# EAGLE design attiny (EAGLE 5.06)
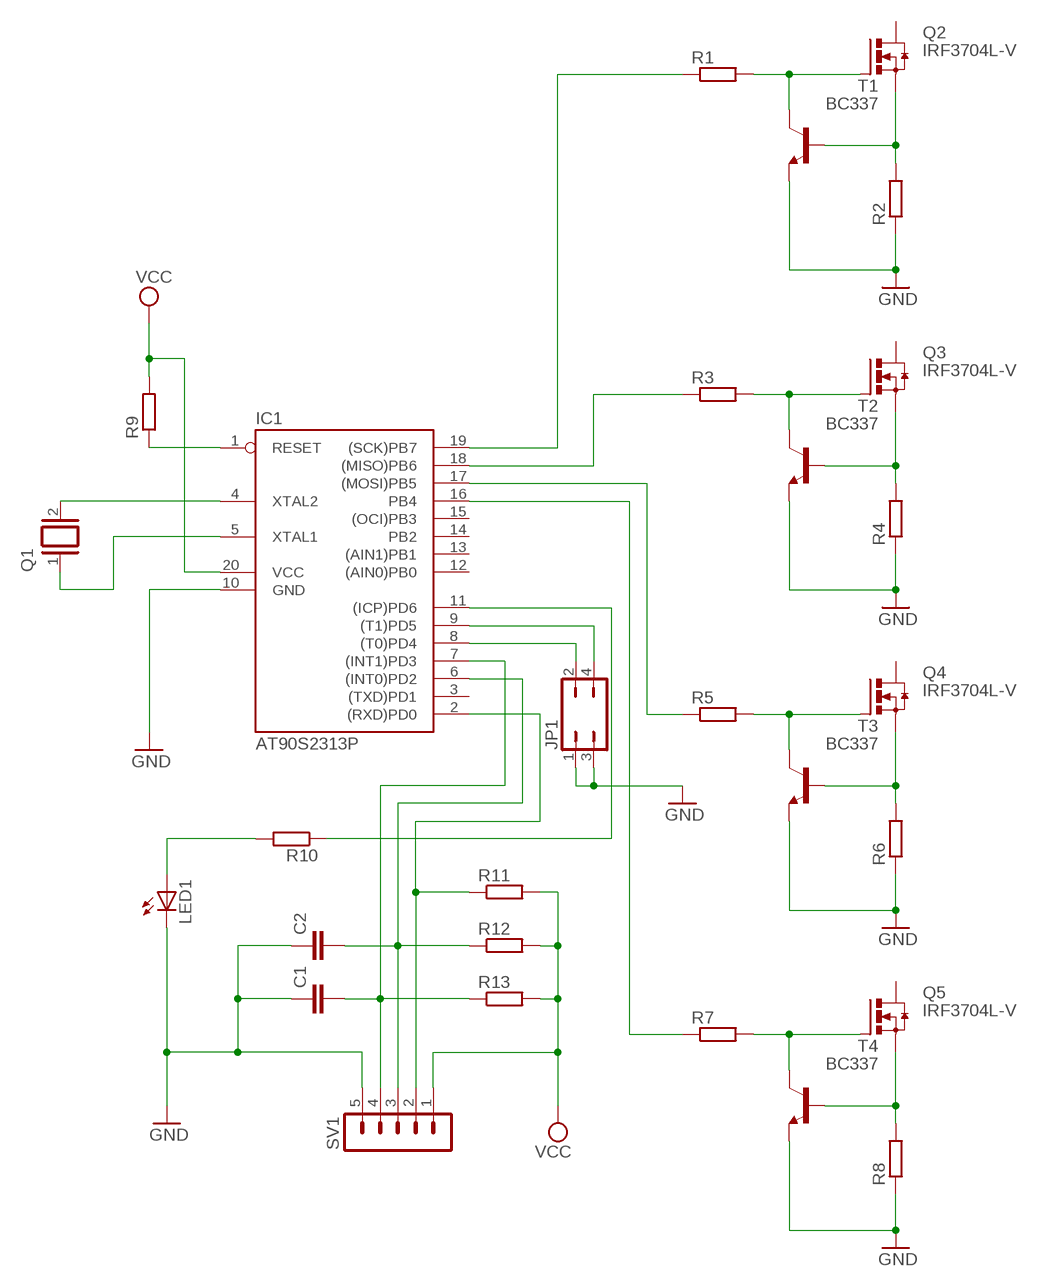
[diagram p0: schematic, sheet 1]

## Parts
C1  C-EU050-025X075  [C050-025X075]
C2  C-EU050-025X075  [C050-025X075]
IC1  AT90S2313P  [DIL20]
JP1  JP2Q  [JP2Q]
LED1  LED3MM  [LED3MM]
Q1  XTAL/S  [QS]
Q2  IRF3704L-V  [TO262-V]
Q3  IRF3704L-V  [TO262-V]
Q4  IRF3704L-V  [TO262-V]
Q5  IRF3704L-V  [TO262-V]
R1  R-EU_0207/15  [0207/15]
R2  R-EU_0922V  [0922V]
R3  R-EU_0207/15  [0207/15]
R4  R-EU_0922V  [0922V]
R5  R-EU_0207/15  [0207/15]
R6  R-EU_0922V  [0922V]
R7  R-EU_0207/15  [0207/15]
R8  R-EU_0922V  [0922V]
R9  R-EU_0207/10  [0207/10]
R10  R-EU_0207/10  [0207/10]
R11  R-EU_0207/10  [0207/10]
R12  R-EU_0207/10  [0207/10]
R13  R-EU_0207/15  [0207/15]
SV1  MA05-1  [MA05-1]
T1  BC337  [TO92]
T2  BC337  [TO92]
T3  BC337  [TO92]
T4  BC337  [TO92]

## Nets
GND: C1.1 C2.1 IC1.10(GND) JP1.1 JP1.3 LED1.K(C) R2.1 R4.1 R6.1 R8.1 SV1.5 T1.1(E) T2.1(E) T3.1(E) T4.1(E)
N$1: Q2.3(S) R2.2 T1.2(B)
N$2: Q2.1(G) R1.2 T1.3(C)
N$3: IC1.9((T1)PD5) JP1.4
N$4: Q3.3(S) R4.2 T2.2(B)
N$6: Q4.3(S) R6.2 T3.2(B)
N$7: Q4.1(G) R5.2 T3.3(C)
N$8: Q5.3(S) R8.2 T4.2(B)
N$9: Q5.1(G) R7.2 T4.3(C)
N$10: IC1.19((SCK)PB7) R1.1
N$11: IC1.18((MISO)PB6) R3.1
N$12: IC1.17((MOSI)PB5) R5.1
N$13: IC1.16(PB4) R7.1
N$14: IC1.4(XTAL2) Q1.2
N$15: IC1.5(XTAL1) Q1.1
N$16: IC1.8((T0)PD4) JP1.2
N$17: Q3.1(G) R3.2 T2.3(C)
N$19: C1.2 IC1.7((INT1)PD3) R13.1 SV1.4
N$20: C2.2 IC1.6((INT0)PD2) R12.1 SV1.3
N$21: IC1.2((RXD)PD0) R11.1 SV1.2
N$22: IC1.11((ICP)PD6) R10.1
N$23: LED1.A R10.2
N$25: IC1.1(RESET) R9.1
VCC: IC1.20(VCC) R9.2 R11.2 R12.2 R13.2 SV1.1
Unconnected: IC1.3((TXD)PD1) IC1.12((AIN0)PB0) IC1.13((AIN1)PB1) IC1.14(PB2) IC1.15((OCI)PB3) Q2.2(D) Q3.2(D) Q4.2(D) Q5.2(D)

## Library data of the parts
C1 C2 = rcl:C-EU: CAPACITOR, European symbol
IC1 = atmel:AT90S2313: MICROCONTROLLER 2 Kbytes FLASH 128 bytes SRAM 128 bytes EEPROM UART
JP1 = jumper:JP2Q: JUMPER
LED1 = led:LED: LED OSRAM: - CHIPLED LG R971, LG N971, LY N971, LG Q971, LY Q971, LO R971, LY R971 LH N974, LH R974 LS Q976, LO Q976, LY Q976 LO Q996 - Hyper CHIPLED LW Q18S LB Q993, LB Q99A, LB R99A - SideLED LS A670, LO A670, LY A670, LG A670, LP A670 LB A673, LV A673, LT A673, LW A673 LH A674 LY A675 LS A676, LA A676, LO A676, LY A676, LW A676 LS A679, LY A679, LG A679 - Hyper Micro SIDELED® LS Y876, LA Y876, LO Y876, LY Y876 LT Y87S - SmartLED LW L88C, LW L88S LB L89C, LB L89S, LG L890 LS L89K, LO L89K, LY L89K LS L896, LA L896, LO L896, LY L896 - TOPLED LS T670, LO T670, LY T670, LG T670, LP T670 LSG T670, LSP T670, LSY T670, LOP T670, LYG T670 LG T671, LOG T671, LSG T671 LB T673, LV T673, LT T673, LW T673 LH T674 LS T676, LA T676, LO T676, LY T676, LB T676, LH T676, LSB T676, LW T676 LB T67C, LV T67C, LT T67C, LS T67K, LO T67K, LY T67K, LW E67C LS E67B, LA E67B, LO E67B, LY E67B, LB E67C, LV E67C, LT E67C LW T67C LS T679, LY T679, LG T679 LS T770, LO T770, LY T770, LG T770, LP T770 LB T773, LV T773, LT T773, LW T773 LH T774 LS E675, LA E675, LY E675, LS T675 LS T776, LA T776, LO T776, LY T776, LB T776 LHGB T686 LT T68C, LB T68C - Hyper Mini TOPLED® LB M676 - Mini TOPLED Santana® LG M470 LS M47K, LO M47K, LY M47K Source: http://www.osram.convergy.de LUXEON: - LUMILED® LXK2-PW12-R00, LXK2-PW12-S00, LXK2-PW14-U00, LXK2-PW14-V00 LXK2-PM12-R00, LXK2-PM12-S00, LXK2-PM14-U00 LXK2-PE12-Q00, LXK2-PE12-R00, LXK2-PE12-S00, LXK2-PE14-T00, LXK2-PE14-U00 LXK2-PB12-K00, LXK2-PB12-L00, LXK2-PB12-M00, LXK2-PB14-N00, LXK2-PB14-P00, LXK2-PB14-Q00 LXK2-PR12-L00, LXK2-PR12-M00, LXK2-PR14-Q00, LXK2-PR14-R00 LXK2-PD12-Q00, LXK2-PD12-R00, LXK2-PD12-S00 LXK2-PH12-R00, LXK2-PH12-S00 LXK2-PL12-P00, LXK2-PL12-Q00, LXK2-PL12-R00 Source: www.luxeon.com KINGBRIGHT: KA-3528ASYC Source: www.kingbright.com
Q1 = special:XTAL/S: CRYSTAL
Q2-Q5 = transistor-power:IRF3704: SMPS MOSFET HEXFET® Power MOSFET Source: http://www.irf.com/product-info/datasheets/data/irf3704.pdf
R1-R13 = rcl:R-EU_: RESISTOR, European symbol
SV1 = con-lstb:MA05-1: PIN HEADER
T1-T4 = transistor:BC337: NPN TRANSISTOR

## Board
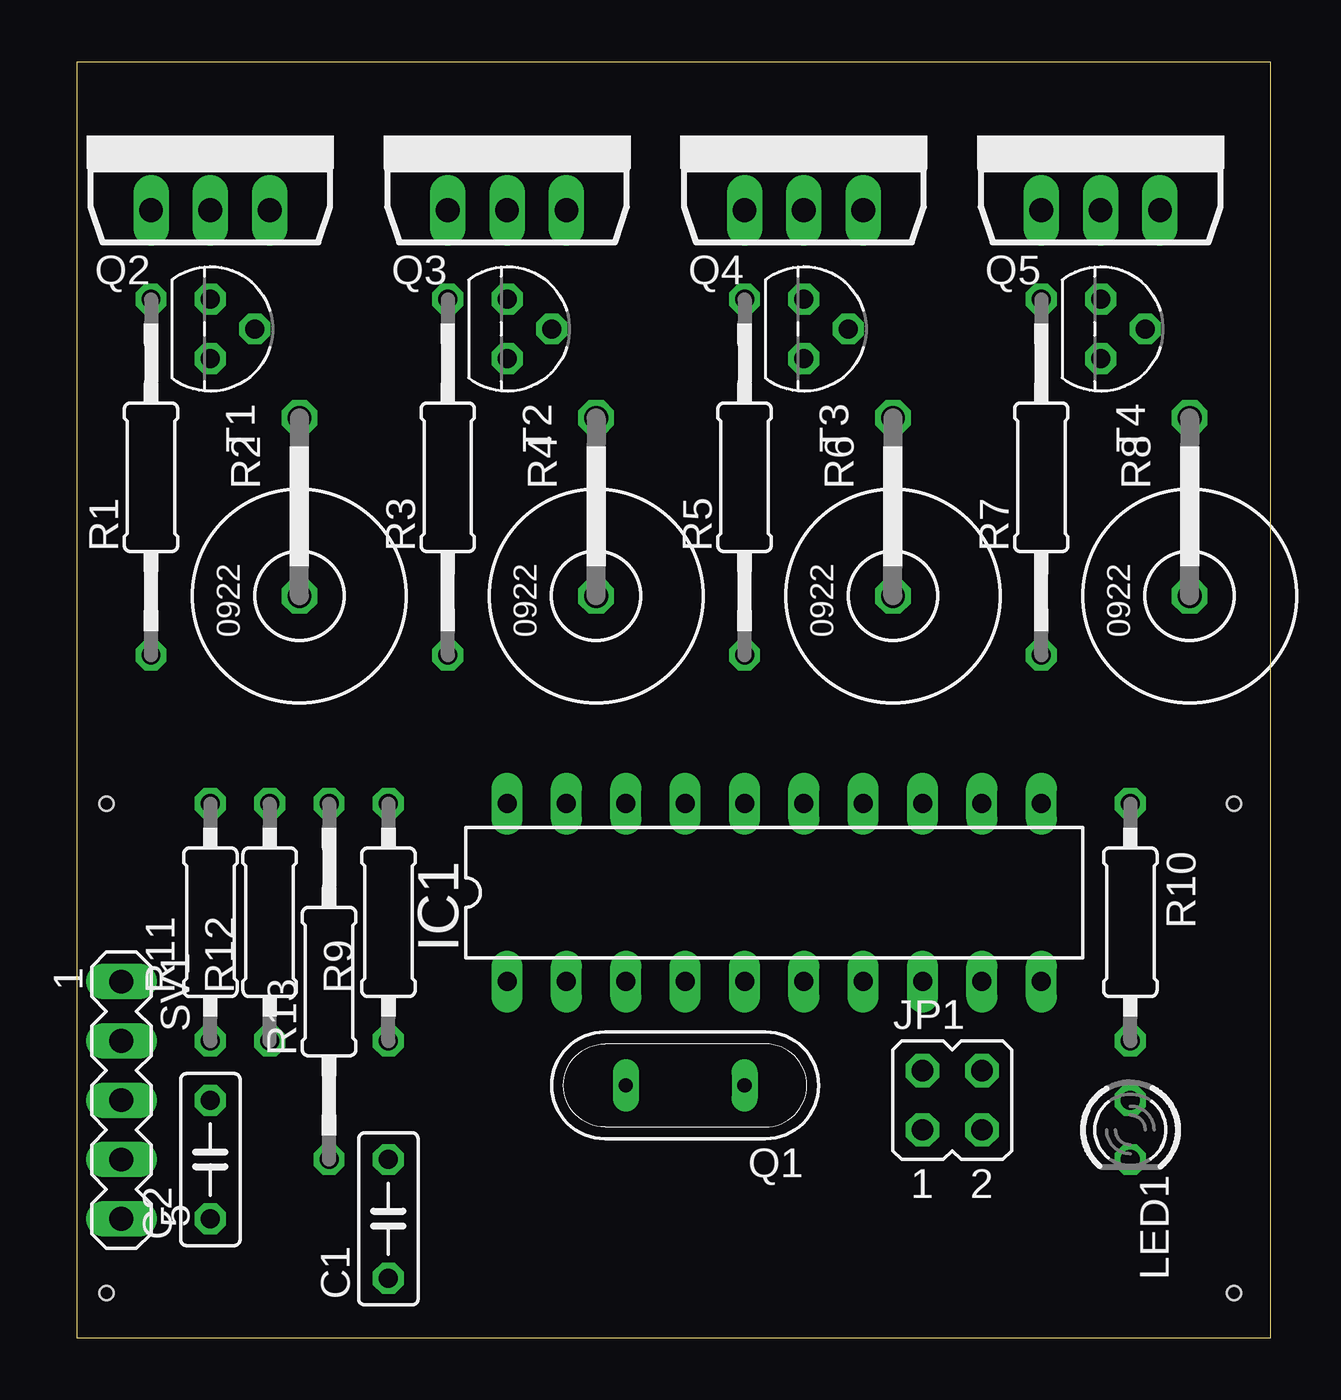
[diagram p1: board, top side]
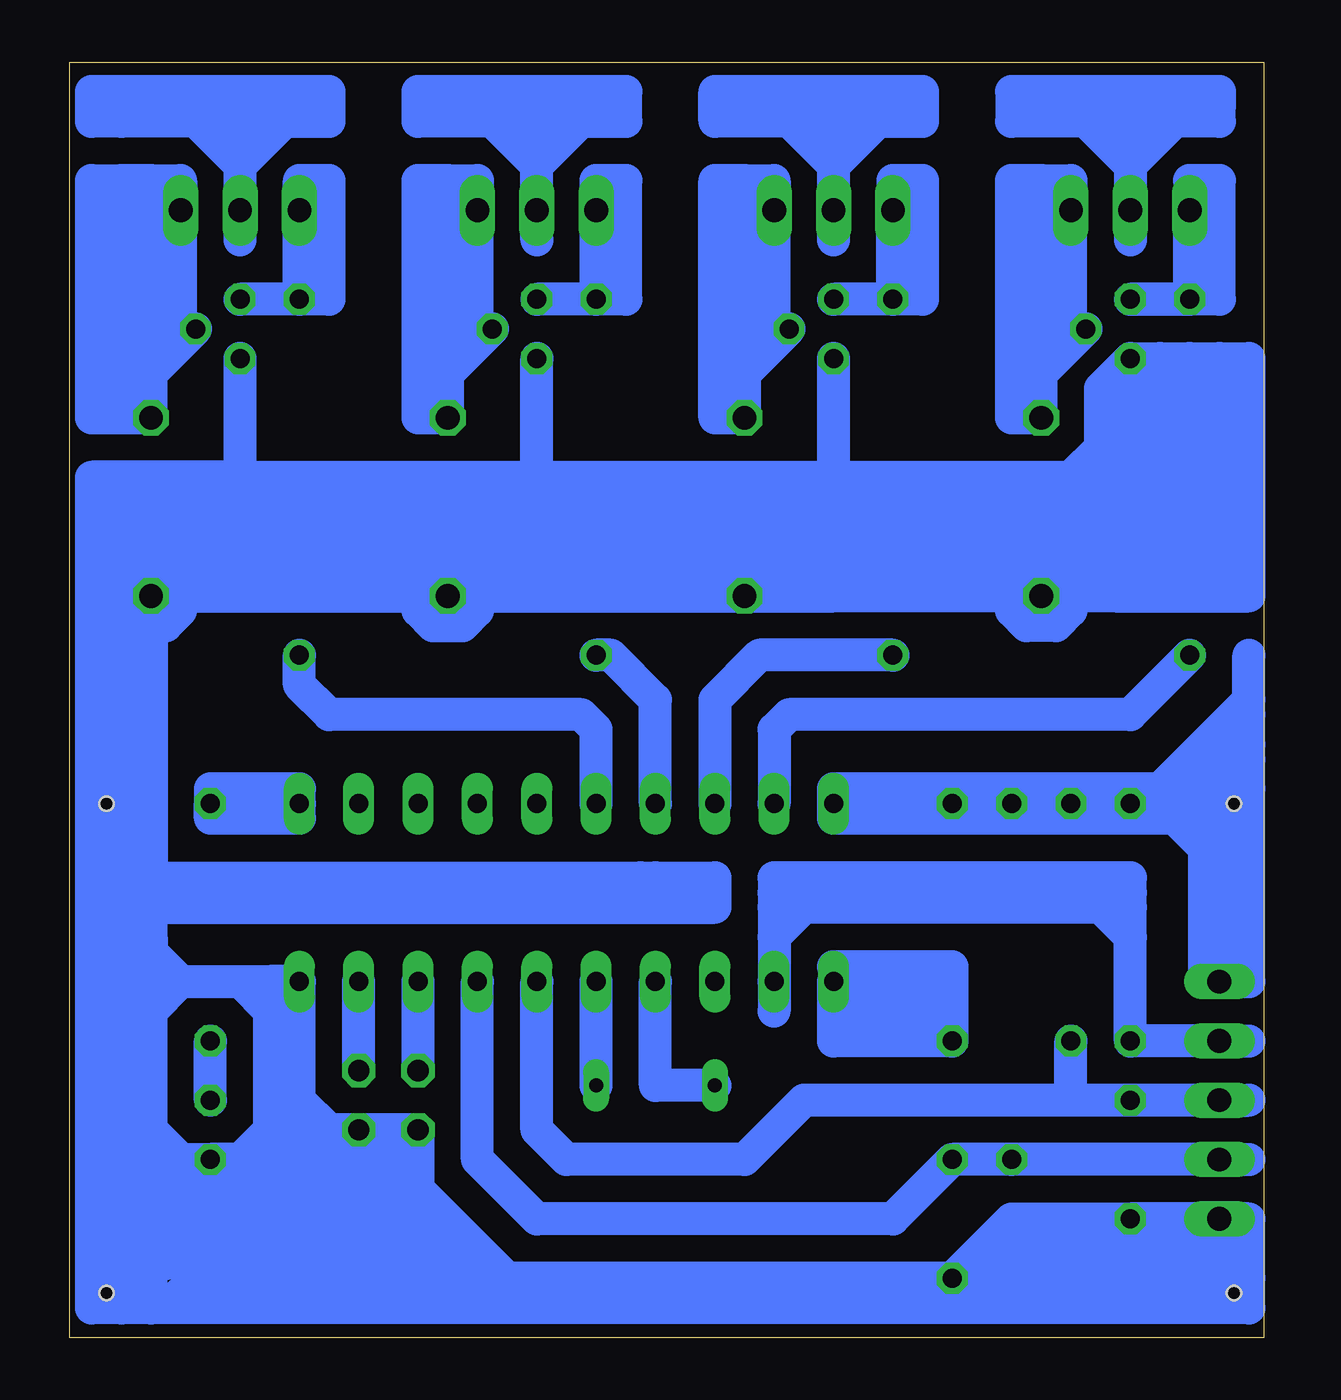
[diagram p2: board, bottom side, seen from below]

Size 51.1 x 54.6 mm. Coordinates in mm from the lower left corner, seen from the top.
Outline: 0,0 51.1,0 51.1,54.6 0,54.6 0,0
Copper layers (1*16): Top 0.035mm / dielectric 1.5mm / Bottom 0.035mm
Design rules "default": minimum track width 10mil, minimum drill 24mil, track to track 8mil, track to pad 8mil, pad to pad 8mil, via to via 8mil, smd to smd 8mil, copper to edge 40mil, drill to drill 8mil, minimum pad ring 10mil, minimum via ring 8mil, stop-mask expansion 4mil, vias tented up to drill 0mil, thermal gap 10mil
Holes 0.6 mm at 49.53,1.91 1.27,1.91 1.27,22.86 49.53,22.86

### Footprints (pad centres in the part's own frame; a part is rotated, then mirrored left to right if it is on the bottom)
C050-025X075 = drill 0.813 octagon: 1 -2.54,0; 2 2.54,0
DIL20 = drill 0.813 long: 1 -11.43,-3.81; 2 -8.89,-3.81; 3 -6.35,-3.81; 4 -3.81,-3.81; 5 -1.27,-3.81; 6 1.27,-3.81; 7 3.81,-3.81; 8 6.35,-3.81; 9 8.89,-3.81; 10 11.43,-3.81; 11 11.43,3.81; 12 8.89,3.81; 13 6.35,3.81; 14 3.81,3.81; 15 1.27,3.81; 16 -1.27,3.81; 17 -3.81,3.81; 18 -6.35,3.81; 19 -8.89,3.81; 20 -11.43,3.81
JP2Q = drill 0.914 octagon: 1 -1.27,-1.27; 2 -1.27,1.27; 3 1.27,-1.27; 4 1.27,1.27
LED3MM = drill 0.813 octagon: A -1.27,0; K 1.27,0
QS = drill 0.61 long: 1 -2.54,0; 2 2.54,0
TO262-V = drill 1.016 long: 1 -2.54,0; 2 0,0; 3 2.54,0
0207/15 = drill 0.813 octagon: 1 -7.62,0; 2 7.62,0
0922V = drill 1.016 octagon: 1 -5.08,0; 2 2.54,0
0207/10 = drill 0.813 octagon: 1 -5.08,0; 2 5.08,0
MA05-1 = drill 1.016 long: 1 -5.08,0; 2 -2.54,0; 3 0,0; 4 2.54,0; 5 5.08,0
TO92 = drill 0.813 octagon: 1 1.27,0; 2 0,1.905; 3 -1.27,0

### Placement (x,y rotation side)
C1  13.34,5.08 90 top
C2  5.71,7.62 90 top
IC1  29.84,19.05 0 top
JP1  37.47,10.16 0 top
LED1  45.09,8.89 270 top
Q1  26.04,10.79 180 top
Q2  5.71,48.26 0 top
Q3  18.41,48.26 0 top
Q4  31.11,48.26 0 top
Q5  43.81,48.26 0 top
R1  3.17,36.83 90 top
R2  9.53,36.83 90 top
R3  15.88,36.83 90 top
R4  22.23,36.83 90 top
R5  28.57,36.83 90 top
R6  34.92,36.83 90 top
R7  41.27,36.83 90 top
R8  47.62,36.83 90 top
R9  13.34,17.78 90 top
R10  45.09,17.78 270 top
R11  5.71,17.78 90 top
R12  8.26,17.78 90 top
R13  10.79,15.24 90 top
SV1  1.91,10.16 270 top
T1  5.71,43.18 270 top
T2  18.41,43.18 270 top
T3  31.11,43.18 270 top
T4  43.81,43.18 270 top

### Tracks (layer width: path | path; a pad name or v marks a point on that pad's centre or on a via)
GND
  Bottom 1.422: 8.26,31.75 R2.1 10.79,31.75 | 6.35,31.75 5.71,31.75 5.71,33.02 | 6.35,31.75 8.26,31.75 | 5.71,34.29 5.71,35.56 | 5.71,36.83 T1.1 | 10.79,31.75 18.41,31.75 | 18.41,31.75 R4.1 31.11,31.75 | 33.66,31.75 R6.1 36.2,31.75 | 33.66,31.75 31.11,31.75 | 43.81,31.75 36.2,31.75 | 43.81,31.75 43.81,36.83 | 43.81,36.83 T4.1 | 31.11,31.75 T3.1 | 18.41,31.75 T2.1 | 41.27,7.62 41.91,7.62 | 43.81,7.62 LED1.K | R8.1 46.35,31.75 | 46.35,31.75 43.81,31.75 | C1.1 10.79,5.08 C2.1 SV1.5 0.64,5.08 0.64,2.54 | 41.27,7.62 41.27,8.89 | 41.27,8.89 41.27,10.16 | 41.27,10.16 IC1.10 41.91,15.24 | 41.27,7.62 41.27,6.99 36.83,2.54 34.92,2.54 | C1.1 32.38,2.54 | 41.91,15.24 42.55,15.24 | 43.81,15.24 42.55,15.24 | 46.35,15.24 47.62,16.51 47.62,17.14 | 47.62,17.14 47.62,18.41 | 47.62,19.05 47.62,18.41 | 47.62,19.68 47.62,19.05 | 41.27,8.89 JP1.3 JP1.1 36.2,6.35 32.38,2.54 | 47.62,19.05 26.04,19.05 26.04,18.41 | 47.62,18.41 26.04,18.41 | 47.62,19.68 47.62,18.41 | 47.62,30.48 47.62,19.68 | R8.1 47.62,30.48 | 47.62,19.68 26.67,19.68 | 26.67,19.68 26.04,19.68 | 0.64,2.54 C1.1 | C1.1 12.06,2.54 10.79,3.81 1.27,3.81 | 0.64,2.54 0.64,1.27 47.62,1.27 | 47.62,1.27 47.62,4.45 | 47.62,4.45 47.62,5.71 | 47.62,5.71 47.62,8.89 | 47.62,8.89 47.62,13.97 | 47.62,13.97 47.62,17.14 | 41.91,7.62 41.91,15.24 | 41.91,6.99 41.91,6.35 41.27,5.71 | 40.01,4.45 41.27,5.71 | 40.01,4.45 38.73,3.17 | 38.73,3.17 37.47,1.91 46.35,1.91 | 47.62,1.27 48.9,1.27 | 48.9,1.27 50.16,1.27 50.16,31.75 | 48.9,31.75 50.16,31.75 | 48.9,31.75 R8.1 | 48.9,1.27 48.9,31.75 | 38.73,3.17 46.99,3.17 | 47.62,4.45 40.01,4.45 | 47.62,5.71 41.27,5.71 | 46.35,7.62 46.99,7.62 | 46.35,7.62 43.81,7.62 | 43.81,7.62 41.91,7.62 | 41.91,6.99 41.91,7.62 | 41.91,6.99 46.99,6.99
  Bottom 1.422: 42.55,15.24 42.55,13.97 | 42.55,9.53 42.55,13.97 | 42.55,9.53 42.55,8.26 | 43.81,15.24 42.55,13.97 | 46.35,15.24 43.81,15.24 | 47.62,13.97 46.35,15.24 | 42.55,9.53 42.55,8.89 43.81,7.62 | 47.62,8.89 46.35,7.62 | 32.38,2.54 34.92,2.54 | 34.92,2.54 34.29,3.17 34.92,3.17 37.47,5.71 37.47,8.26 40.01,8.26 | 40.01,8.26 40.64,8.26 40.64,7.62 40.01,6.99 38.1,6.99 38.1,5.71 38.73,5.71 | 38.73,5.71 39.37,5.71 | 38.73,5.71 36.2,3.17 | 40.01,8.26 40.01,8.89 41.27,10.16 | T1.1 6.99,40.64 6.99,38.1 8.26,36.83 | 43.81,36.83 8.26,36.83 | 43.81,36.83 50.16,36.83 50.16,35.56 | 50.16,31.75 50.16,34.29 | 6.35,37.47 7.62,37.47 8.26,36.83 | 5.71,36.83 8.26,36.83 | 5.71,35.56 5.71,36.83 | 50.16,35.56 5.71,35.56 | 50.16,34.29 50.16,35.56 | 50.16,34.29 5.71,34.29 | 5.71,34.29 5.71,33.02 | 5.71,33.02 49.53,33.02 | 8.26,31.75 8.26,31.11 8.89,30.48 10.16,30.48 10.79,31.11 10.79,31.75 | 33.66,31.75 33.66,31.11 34.29,30.48 35.56,30.48 36.2,31.11 36.2,31.75 | 46.35,31.75 46.35,31.11 46.99,30.48 47.62,30.48 | 6.35,31.75 4.45,31.75 | 4.45,31.75 3.17,31.75 | 1.91,31.75 0.64,31.75 0.64,41.91 1.91,41.91 | 3.17,41.91 1.91,41.91 | T1.1 4.45,41.91 | 1.91,31.75 1.91,41.91 | 3.17,31.75 1.91,31.75 | 3.17,41.91 3.17,31.75 | 4.45,41.91 3.17,41.91 | 4.45,31.75 4.45,41.91 | 26.04,18.41 23.5,18.41 23.5,19.68 26.67,19.68
N$1
  Bottom 1.422: T1.2 8.26,43.18 Q2.3 8.26,49.53 9.53,49.53 | 9.53,41.27 9.53,43.18 T1.2 | 9.53,49.53 10.79,49.53 10.79,39.37 R2.2 9.53,41.27 | 9.53,41.27 9.53,49.53 | 9.53,41.27 T1.2
N$2
  Bottom 1.422: R1.2 Q2.1 2.54,48.26 3.17,48.9 3.17,49.53 1.91,49.53 1.91,44.45 T1.3 R1.2
N$3
  Bottom 1.422: JP1.4 IC1.9
N$4
  Bottom 1.422: 20.95,43.18 Q3.3 20.95,49.53 22.23,49.53 | T2.2 20.95,43.18 | 22.23,41.27 22.23,43.18 20.95,43.18 | 22.23,49.53 23.5,49.53 23.5,39.37 R4.2 22.23,41.27 | 22.23,41.27 22.23,49.53 | T2.2 21.59,41.91 | 22.23,41.27 T2.2
N$6
  Bottom 1.422: T3.2 33.66,43.18 Q4.3 33.66,49.53 34.92,49.53 | 34.92,41.27 34.92,43.18 T3.2 | 34.92,49.53 36.2,49.53 36.2,39.37 R6.2 34.92,41.27 | 34.92,41.27 34.92,49.53 | 34.92,41.27 T3.2
N$7
  Bottom 1.422: R5.2 Q4.1 28.57,49.53 27.3,49.53 27.3,44.45 R5.2 | R5.2 T3.3
N$8
  Bottom 1.422: T4.2 46.35,43.18 Q5.3 46.35,49.53 47.62,49.53 | 47.62,41.27 47.62,43.18 T4.2 | 47.62,49.53 48.9,49.53 | 48.9,49.53 48.9,39.37 R8.2 | R8.2 47.62,41.27 | 47.62,41.27 47.62,49.53 | 47.62,41.27 T4.2 | 48.9,49.53 50.16,49.53 50.16,39.37 R8.2
N$9
  Bottom 1.422: R7.2 Q5.1 41.27,49.53 40.01,49.53 40.01,44.45 R7.2 | R7.2 T4.3
N$10
  Bottom 1.422: IC1.19 20.95,26.04 20.32,26.67 5.71,26.67 R1.1
N$11
  Bottom 1.422: R3.1 21.59,29.21 23.5,27.3 IC1.18
N$12
  Bottom 1.422: R5.1 27.94,29.21 26.04,27.3 IC1.17
N$13
  Bottom 1.422: IC1.16 28.57,26.04 29.21,26.67 40.01,26.67 41.27,27.94 R7.1
N$14
  Bottom 1.422: IC1.4 26.04,10.79 Q1.2
N$15
  Bottom 1.422: Q1.1 IC1.5
N$16
  Bottom 1.422: JP1.2 IC1.8
N$17
  Bottom 1.422: 15.88,48.9 15.88,49.53 14.61,49.53 14.61,44.45 R3.2 | R3.2 Q3.1 | R3.2 T2.3
N$18
  Bottom 1.422: 3.81,52.07 1.91,52.07 1.91,53.34 | 3.81,52.07 7.62,52.07 | 7.62,52.07 10.79,52.07 10.79,53.34 1.91,53.34 | 1.91,53.34 1.91,52.7 5.71,52.7 5.71,50.16 | 5.71,50.16 5.71,46.99 | 3.81,52.07 5.71,50.16 | 7.62,52.07 5.71,50.16
N$19
  Bottom 1.422: IC1.7 33.66,7.62 31.11,5.08 15.88,5.08 C1.2 R13.1 SV1.4 0.64,7.62
N$20
  Bottom 1.422: 8.26,10.16 R12.1 | 8.26,10.16 C2.2 SV1.3 0.64,10.16 | IC1.6 31.11,8.89 29.84,7.62 22.23,7.62 19.68,10.16 8.26,10.16
N$21
  Bottom 1.422: SV1.2 R11.1 | SV1.2 R11.1 | R11.1 5.71,17.14 | 5.71,17.14 5.71,18.41 | 5.71,18.41 5.71,19.05 20.95,19.05 20.95,18.41 | SV1.2 0.64,12.7 | 20.95,13.97 IC1.2 20.95,17.14 | 20.95,18.41 20.95,17.14 | 19.68,18.41 20.95,18.41 | 6.99,18.41 19.68,18.41 | 5.71,18.41 6.99,18.41 | 5.71,18.41 5.71,19.68 20.95,19.68 20.95,18.41 | 19.68,18.41 20.95,17.14 | 5.71,17.14 6.99,18.41
N$22
  Bottom 1.422: R10.1 IC1.11 | R10.1 45.09,22.23 41.27,22.23 41.27,23.5 45.09,23.5 R10.1
N$23
  Bottom 1.422: LED1.A R10.2
N$24
  Bottom 1.422: 16.51,52.07 14.61,52.07 14.61,53.34 23.5,53.34 23.5,52.07 20.32,52.07 | 18.41,52.07 16.51,52.07 | 18.41,52.07 20.32,52.07 | 18.41,46.99 18.41,50.16 | 18.41,50.16 18.41,52.07 | 18.41,50.16 16.51,52.07 | 18.41,50.16 20.32,52.07
N$25
  Bottom 1.422: 18.41,15.88 13.34,15.88 13.34,13.34 | 18.41,13.34 18.41,12.7 R9.1 13.34,13.34 | 18.41,14.61 IC1.1 | 13.34,13.34 18.41,13.34 | 18.41,13.34 18.41,14.61 | 18.41,14.61 13.97,14.61
N$26
  Bottom 1.422: 33.02,52.07 36.2,52.07 36.2,53.34 27.3,53.34 27.3,52.07 29.21,52.07 | 31.11,52.07 33.02,52.07 | 31.11,52.07 29.21,52.07 | 31.11,46.99 31.11,50.16 | 31.11,50.16 31.11,52.07 | 31.11,50.16 29.21,52.07 | 31.11,50.16 33.02,52.07
N$27
  Bottom 1.422: 41.91,52.07 40.01,52.07 40.01,53.34 48.9,53.34 | 43.81,52.07 41.91,52.07 | 43.81,52.07 45.72,52.07 | 45.72,52.07 48.9,52.07 | 48.9,52.07 48.9,53.34 | 43.81,46.99 43.81,50.16 | 43.81,50.16 43.81,52.07 | 43.81,50.16 41.91,52.07 | 43.81,50.16 45.72,52.07 | 48.9,53.34 50.16,53.34 50.16,52.07 48.9,52.07
VCC
  Bottom 1.422: SV1.1 1.91,22.23 | 1.91,22.23 1.91,22.86 R11.2 R12.2 R13.2 R9.2 IC1.20 | 3.81,22.23 18.41,22.23 18.41,23.5 4.45,23.5 | 1.91,22.23 3.81,22.23 | 2.54,23.5 4.45,23.5 | SV1.1 1.91,23.5 | SV1.1 0.64,15.24 0.64,23.5 | 1.91,23.5 2.54,23.5 | 2.54,23.5 2.54,20.95 | 2.54,20.95 2.54,15.24 | 3.81,22.23 2.54,20.95 | 0.64,24.77 0.64,25.4 | 4.45,23.5 2.54,25.4 | 4.45,23.5 3.17,23.5 1.91,24.77 | 2.54,25.4 0.64,25.4 | 2.54,25.4 0.64,27.3 0.64,26.67 | 0.64,25.4 0.64,26.67 | 1.91,23.5 0.64,23.5 | 0.64,23.5 0.64,24.77 | 1.91,24.77 0.64,24.77 | 1.91,23.5 1.91,24.77 | 0.64,26.67 0.64,29.21